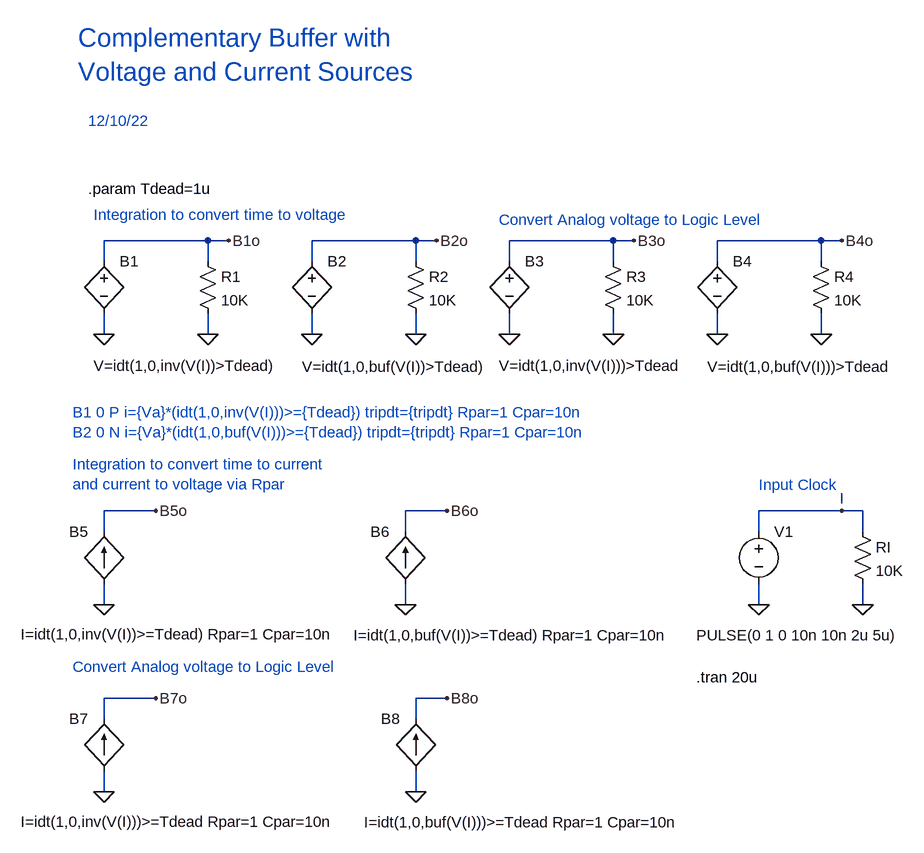
[diagram p0: schematic ComplementaryBuffer.asc]
ComplementaryBuffer.asc, the LTspice schematic file:
Version 4
SHEET 1 1844 1456
WIRE -384 224 -544 224
WIRE -352 224 -384 224
WIRE -64 224 -224 224
WIRE -32 224 -64 224
WIRE 240 224 80 224
WIRE 272 224 240 224
WIRE 560 224 400 224
WIRE 592 224 560 224
WIRE -544 256 -544 224
WIRE -384 256 -384 224
WIRE -224 256 -224 224
WIRE -64 256 -64 224
WIRE 80 256 80 224
WIRE 240 256 240 224
WIRE 400 256 400 224
WIRE 560 256 560 224
WIRE -544 368 -544 336
WIRE -384 368 -384 336
WIRE -224 368 -224 336
WIRE -64 368 -64 336
WIRE 80 368 80 336
WIRE 240 368 240 336
WIRE 400 368 400 336
WIRE 560 368 560 336
WIRE -464 640 -544 640
WIRE -16 640 -80 640
WIRE 592 640 464 640
WIRE 624 640 592 640
WIRE -544 672 -544 640
WIRE -80 672 -80 640
WIRE 464 672 464 640
WIRE 624 672 624 640
WIRE -544 784 -544 752
WIRE -80 784 -80 752
WIRE 464 784 464 752
WIRE 624 784 624 752
WIRE -464 928 -544 928
WIRE -16 928 -64 928
WIRE -544 960 -544 928
WIRE -64 960 -64 928
WIRE -544 1072 -544 1040
WIRE -64 1072 -64 1040
FLAG -224 368 0
FLAG -544 368 0
FLAG -384 368 0
FLAG -64 368 0
FLAG -352 224 B1o
FLAG -32 224 B2o
FLAG 464 784 0
FLAG 624 784 0
FLAG 592 640 I
FLAG 400 368 0
FLAG 80 368 0
FLAG 240 368 0
FLAG 560 368 0
FLAG 272 224 B3o
FLAG 592 224 B4o
FLAG -544 784 0
FLAG -464 640 B5o
FLAG -16 640 B6o
FLAG -80 784 0
FLAG -544 1072 0
FLAG -464 928 B7o
FLAG -16 928 B8o
FLAG -64 1072 0
SYMBOL bv -544 240 R0
WINDOW 3 -16 177 Left 2
SYMATTR Value V=idt(1,0,inv(V(I))>Tdead)
SYMATTR InstName B1
SYMBOL bv -224 240 R0
WINDOW 3 -15 178 Left 2
SYMATTR Value V=idt(1,0,buf(V(I))>Tdead)
SYMATTR InstName B2
SYMBOL res -400 240 R0
SYMATTR InstName R1
SYMATTR Value 10K
SYMBOL res -80 240 R0
SYMATTR InstName R2
SYMATTR Value 10K
SYMBOL voltage 464 656 R0
WINDOW 3 -96 175 Left 2
WINDOW 123 0 0 Left 0
WINDOW 39 0 0 Left 0
SYMATTR Value PULSE(0 1 0 10n 10n 2u 5u)
SYMATTR InstName V1
SYMBOL res 608 656 R0
SYMATTR InstName RI
SYMATTR Value 10K
SYMBOL bv 80 240 R0
WINDOW 3 -16 177 Left 2
SYMATTR Value V=idt(1,0,inv(V(I)))>Tdead
SYMATTR InstName B3
SYMBOL bv 400 240 R0
WINDOW 3 -15 178 Left 2
SYMATTR Value V=idt(1,0,buf(V(I)))>Tdead
SYMATTR InstName B4
SYMBOL res 224 240 R0
SYMATTR InstName R3
SYMATTR Value 10K
SYMBOL res 544 240 R0
SYMATTR InstName R4
SYMATTR Value 10K
SYMBOL bi -544 752 R180
WINDOW 0 24 80 Left 2
WINDOW 3 128 -78 Right 2
SYMATTR InstName B5
SYMATTR Value I=idt(1,0,inv(V(I))>=Tdead) Rpar=1 Cpar=10n
SYMBOL bi -80 752 R180
WINDOW 0 24 80 Left 2
WINDOW 3 80 -79 Right 2
SYMATTR InstName B6
SYMATTR Value I=idt(1,0,buf(V(I))>=Tdead) Rpar=1 Cpar=10n
SYMBOL bi -544 1040 R180
WINDOW 0 24 80 Left 2
WINDOW 3 128 -78 Right 2
SYMATTR InstName B7
SYMATTR Value I=idt(1,0,inv(V(I)))>=Tdead Rpar=1 Cpar=10n
SYMBOL bi -64 1040 R180
WINDOW 0 24 80 Left 2
WINDOW 3 80 -79 Right 2
SYMATTR InstName B8
SYMATTR Value I=idt(1,0,buf(V(I)))>=Tdead Rpar=1 Cpar=10n
TEXT -584 -88 Left 4 ;Complementary Buffer with\nVoltage and Current Sources
TEXT -568 40 Left 2 ;12/10/22
TEXT -568 144 Left 2 !.param Tdead=1u
TEXT 368 896 Left 2 !.tran 20u
TEXT -560 184 Left 2 ;Integration to convert time to voltage
TEXT 464 600 Left 2 ;Input Clock
TEXT 64 192 Left 2 ;Convert Analog voltage to Logic Level
TEXT -592 488 Left 2 ;B1 0 P i={Va}*(idt(1,0,inv(V(I)))>={Tdead}) tripdt={tripdt} Rpar=1 Cpar=10n\nB2 0 N i={Va}*(idt(1,0,buf(V(I)))>={Tdead}) tripdt={tripdt} Rpar=1 Cpar=10n
TEXT -592 568 Left 2 ;Integration to convert time to current\nand current to voltage via Rpar
TEXT -592 880 Left 2 ;Convert Analog voltage to Logic Level

The netlist it stands for:
* ComplementaryBuffer.asc
B1 B1o 0 V=idt(1,0,inv(V(I))>Tdead)
B2 B2o 0 V=idt(1,0,buf(V(I))>Tdead)
R1 B1o 0 10K
R2 B2o 0 10K
V1 I 0 PULSE(0 1 0 10n 10n 2u 5u)
RI I 0 10K
B3 B3o 0 V=idt(1,0,inv(V(I)))>Tdead
B4 B4o 0 V=idt(1,0,buf(V(I)))>Tdead
R3 B3o 0 10K
R4 B4o 0 10K
B5 0 B5o I=idt(1,0,inv(V(I))>=Tdead) Rpar=1 Cpar=10n
B6 0 B6o I=idt(1,0,buf(V(I))>=Tdead) Rpar=1 Cpar=10n
B7 0 B7o I=idt(1,0,inv(V(I)))>=Tdead Rpar=1 Cpar=10n
B8 0 B8o I=idt(1,0,buf(V(I)))>=Tdead Rpar=1 Cpar=10n
* Complementary Buffer with
* Voltage and Current Sources
* 12/10/22
.param Tdead=1u
.tran 20u
* Integration to convert time to voltage
* Input Clock
* Convert Analog voltage to Logic Level
* B1 0 P i={Va}*(idt(1,0,inv(V(I)))>={Tdead}) tripdt={tripdt} Rpar=1 Cpar=10n
* B2 0 N i={Va}*(idt(1,0,buf(V(I)))>={Tdead}) tripdt={tripdt} Rpar=1 Cpar=10n
* Integration to convert time to current
* and current to voltage via Rpar
* Convert Analog voltage to Logic Level
.backanno
.end